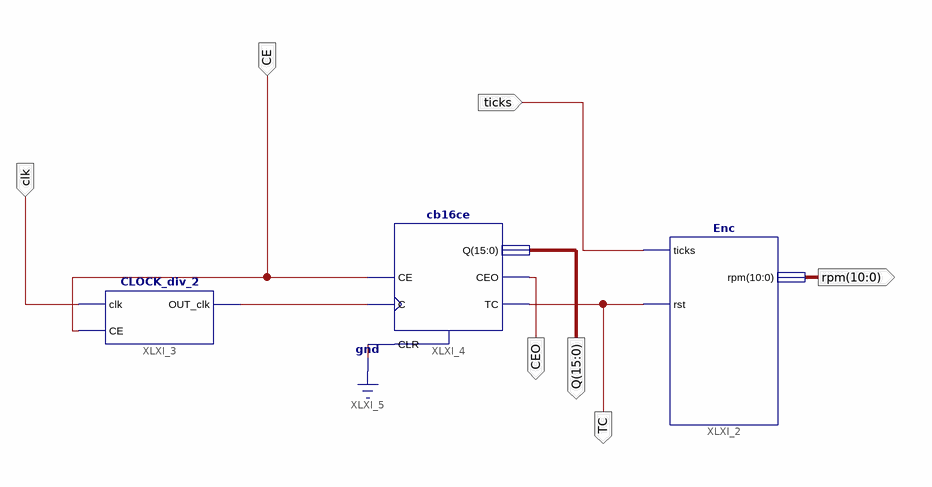
[diagram p0: schematic sheet 1]
// Xilinx ISE schematic encoder.sch (spartan3e) as structural Verilog: 3 symbols, 7 ports
module encoder (
  input  CE,
  input  clk,
  input  ticks,
  output TC,
  output CEO,
  output [15:0] Q,
  output [10:0] rpm
);

  wire XLXN_1;

  Enc XLXI_2 (.ticks(ticks), .rst(TC), .rpm(rpm));
  CLOCK_div_2 XLXI_3 (.clk(clk), .CE(CE), .OUT_clk(XLXN_1));
  cb16ce XLXI_4 (.C(XLXN_1), .CE(CE), .CLR(1'b0), .CEO(CEO), .Q(Q), .TC(TC));
endmodule
